# Altium project PCB_3U_DAC.PrjPCB (part 3 of 3)

## Sheet Thermal_MGM.SchDoc: Thermal
size 420 x 297 mm; Author: G.K.; CompanyName: WUT; DrawnBy: G.K.; Organization: WUT ISE; Address1: Warsaw Univeristy of Technology; Address2: Nowowiejska 15/19; DocumentNumber: 6; Revision: -; SheetNumber: 6; SheetTotal: 7; EDA_Number: ARTIQ; Projet: ARTIQ/SINARA; ModifiedBy: -; CreateDate: XX/XX/XXXX; CheckedDate: -; Title2: management; DivGrp: ISE; Designer: G.K.; ModifiedDate: -; ProjectName: 32 CHANNEL 16bit DAC
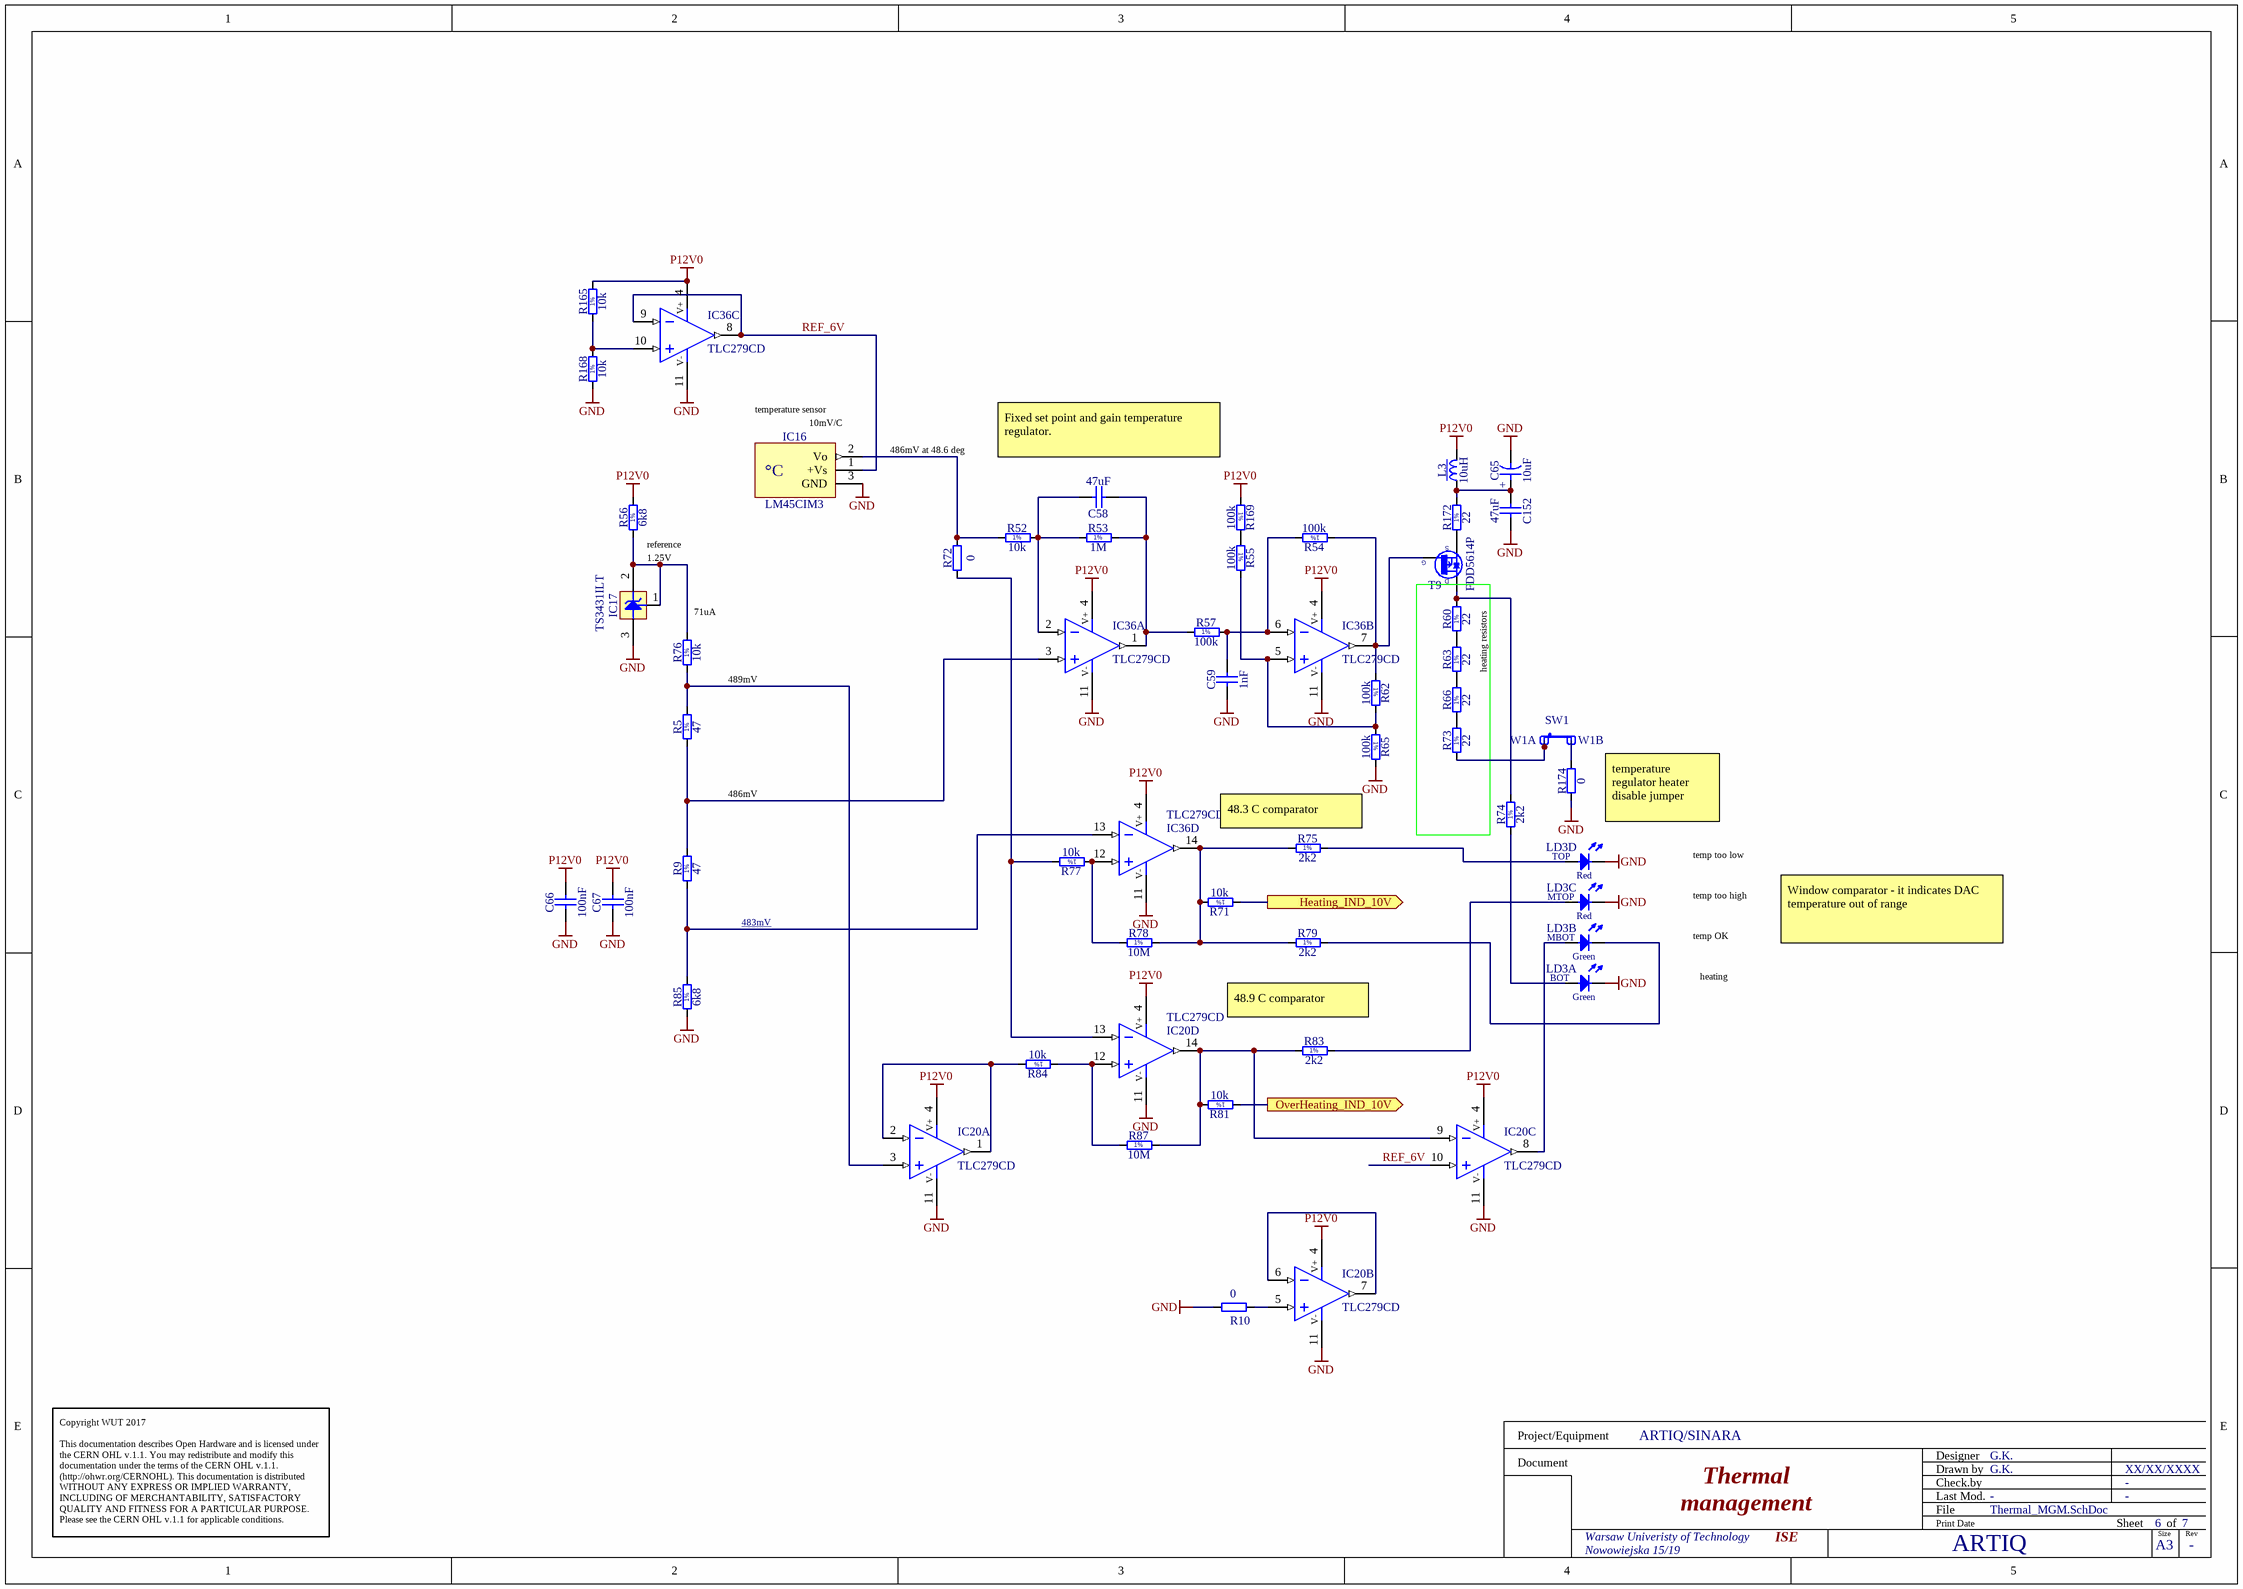
[diagram p5: Thermal_MGM.SchDoc]

### Parts
C58  47uF  [CAPC3225X270N]
C59  1nF  [CAPC1608X87N]
C65  10uF  [CAPMP3216X180N]
C66  100nF  [CAPC1005X55N]
C67  100nF  [CAPC1005X55N]
C152  47uF  [CAPC3225X270N]
IC16  LM45CIM3  [SOT95P251X112-3N]
IC17  TS3431ILT  [SOT95P237X112-3N]
IC20  TLC279CD  [SOIC127P600X175-14N]  (parts A,B,C,D of 4)
IC36  TLC279CD  [SOIC127P600X175-14N]  (parts A,B,C,D of 4)
L3  10uH  [IND_MURATA-PS_8400]
LD3  Green/Green/HeRed/HeRed  [LED_BIVAR_H485CHHGGDL]  (value not drawn)  (parts A,B,C,D of 4)
R5  47  [RESC1608X55N]
R9  47  [RESC1608X55N]
R10  0  [RESC1005X40N]
R52  10k  [RESC1608X55N]
R53  1M  [RESC1608X55N]
R54  100k  [RESC1608X55N]
R55  100k  [RESC1608X55N]
R56  6k8  [RESC1608X55N]
R57  100k  [RESC1608X55N]
R60  22  [RESC3216X65N]
R62  100k  [RESC1608X55N]
R63  22  [RESC3216X65N]
R65  100k  [RESC1608X55N]
R66  22  [RESC3216X65N]
R71  10k  [RESC1608X55N]
R72  0  [RESC1005X40N]
R73  22  [RESC3216X65N]
R74  2k2  [RESC1608X55N]
R75  2k2  [RESC1608X55N]
R76  10k  [RESC1608X55N]
R77  10k  [RESC1608X55N]
R78  10M  [RESC1508X63N]
R79  2k2  [RESC1608X55N]
R81  10k  [RESC1608X55N]
R83  2k2  [RESC1608X55N]
R84  10k  [RESC1608X55N]
R85  6k8  [RESC1608X55N]
R87  10M  [RESC1508X63N]
R165  10k  [RESC1608X55N]
R168  10k  [RESC1608X55N]
R169  100k  [RESC1608X55N]
R172  22  [RESC3216X65N]
R174  0  [RESC1005X40N]
SW1  Jumper Type1  [JUMPER_BLACK_INSULATED_2.54MM]  (value not drawn)
T9  FDD5614P  [TO228P991X238-3N-R546X521]
W1  Test Point  [COMATEL_385.0358.1.02.400]  (value not drawn)  (parts A,B of 2)

### Ports
Heating_IND_10V (out), OverHeating_IND_10V (out)

### Nets
GND: C59.1 C65.2 C66.1 C67.1 C152.2 IC16.3(GND) IC17.3(A) IC20.11(V-) IC36.11(V-) LD3.1(C) LD3.5(C) LD3.7(C) R10.2 R65.2 R85.1 R168.1 R174.1
P12V0: C66.2 C67.2 IC20.4(V+) IC36.4(V+) L3.2 R56.2 R165.2 R169.1
REF_6V: IC16.1(+Vs) IC20.10(IN+) IC36.8(OUT) IC36.9(IN-)
NetC58_1: C58.1 IC36.1(OUT) R53.2 R57.1
NetC58_2: C58.2 IC36.2(IN-) R52.2 R53.1
NetC59_2: C59.2 IC36.6(IN-) R54.2 R57.2
NetC65_1: C65.1 C152.1 L3.1 R172.2
NetIC13_4: R81.1 ; port OverHeating_IND_10V
NetIC13_5: R71.1 ; port Heating_IND_10V
NetIC16_2: IC16.2(Vo) R52.1 R72.2
NetIC17_1: IC17.1(Adj) IC17.2(C) R56.1 R76.2
NetIC20_1: IC20.1(OUT) IC20.2(IN-) R84.2
NetIC20_3: IC20.3(IN+) R5.2 R76.1
NetIC20_5: IC20.5(IN+) R10.1
NetIC20_6: IC20.6(IN-) IC20.7(OUT)
NetIC20_8: IC20.8(OUT) LD3.4(A)
NetIC20_9: IC20.9(IN-) IC20.14(OUT) R81.2 R83.1 R87.2
NetIC20_12: IC20.12(IN+) R84.1 R87.1
NetIC20_13: IC20.13(IN-) R72.1 R77.2
NetIC36_3: IC36.3(IN+) R5.1 R9.2
NetIC36_5: IC36.5(IN+) R55.2 R62.2 R65.1
NetIC36_7: IC36.7(OUT) R54.1 R62.1 T9.1(G)
NetIC36_10: IC36.10(IN+) R165.1 R168.2
NetIC36_12: IC36.12(IN+) R77.1 R78.1
NetIC36_13: IC36.13(IN-) R9.1 R85.2
NetIC36_14: IC36.14(OUT) R71.2 R75.1 R78.2 R79.1
NetLD3_2: LD3.2(A) R74.1
NetLD3_3: LD3.3(C) R79.2
NetLD3_6: LD3.6(A) R83.2
NetLD3_8: LD3.8(A) R75.2
NetR55_1: R55.1 R169.2
NetR60_1: R60.1 R63.2
NetR60_2: R60.2 R74.2 T9.3(D)
NetR63_1: R63.1 R66.2
NetR66_1: R66.1 R73.2
NetR73_1: R73.1 SW1.1 W1.1
NetR172_1: R172.1 T9.2(S)
NetR174_2: R174.2 W1.2

### Notes on the sheet
- temperature sensor
- (near IC16) 10mV/C
- 486mV at 48.6 deg
- Fixed set point and gain temperature regulator.
- 1.25V
- (near R56) reference
- (near R76) 71uA
- heating resistors
- 489mV
- 486mV
- (near R75) 48.3 C comparator
- temperature regulator heater disable jumper
- temp too low
- 483mV
- temp too high
- temp OK
- Window comparator - it indicates DAC temperature out of range
- heating
- 48.9 C comparator
- Copyright WUT 2017
  This documentation describes Open Hardware and is licensed under the CERN OHL v.1.1. You may redistribute and modify this documentation under the terms of the CERN OHL v.1.1. (http://ohwr.org/CERNOHL). This documentation is distributed WITHOUT ANY EXPRESS OR IMPLIED WARRANTY, INCLUDING OF MERCHANTABILITY, SATISFACTORY QUALITY AND FITNESS FOR A PARTICULAR PURPOSE. Please see the CERN OHL v.1.1 for applicable conditions.
- Project/Equipment
- Document
- Designer
- Drawn by
- Check.by
- File
- Last Mod.
- Print Date
- Sheet
- Size
- A3
- of
- Rev
- (in symbol CTE3216-18_10UF_16V_20%_AVX_TCJ) +
- (in symbol LED_BIVAR_H485CHHGGDL, part A) BOT; Green
- (in symbol LED_BIVAR_H485CHHGGDL, part B) MBOT; Green
- (in symbol LED_BIVAR_H485CHHGGDL, part C) MTOP; Red
- (in symbol LED_BIVAR_H485CHHGGDL, part D) TOP; Red
- (in symbol LM45CIM3) °C
- (in symbol R0603_1M_1%_0.1W_100PPM) 1%
- (in symbol R0603_2K2_1%_0.1W_100PPM) 1%
- (in symbol R0603_6K8_1%_0.1W_100PPM) 1%
- (in symbol R0603_10K_1%_0.1W_100PPM) 1%
- (in symbol R0603_10M_1%_0.125W_100PPM_VISHAY_CHP) 1%
- (in symbol R0603_47R_1%_0.1W_100PPM) 1%
- (in symbol R0603_100K_1%_0.1W_100PPM) 1%
- (in symbol R1206_22R_1%_0.25W_100PPM) 1%

### Library data of the parts
C58 C152 = CC1210_47UF_10V_10%_X7R: Non-polarised capacitor; Part Description: SMD Multilayer Chip Ceramic Capacitor; Manufacturer: GENERIC; Manufacturer1 Part Number: GRM32ER71A476KE15; Voltage: 10V; TC: X7R; Tolerance: ±10%; Part Number: CC1210_47UF_10V_10%_X7R; Component Kind: Standard; Component Type: Standard; Pin Count: 2; Value: 47uF; Status: None; Manufacturer Part Number: CC1210_47UF_10V_10%_X7R; Case: 1210; Mounted: Yes; Socket: No; SMD: Yes; Sense: No; Manufacturer1 Example: MURATA; Manufacturer1 ComponentHeight: 2.7mm; HelpURL: \\cern.ch\dfs\Applications\Altium\Datasheets\CC1210_X7R_MURATA.pdf; Author: CERN DEM BC; CreateDate: 18.11.2015; LatestRevisionDate: 18.11.2015
C59 = CC0603_1NF_50V_10%_X7R: Non-polarised capacitor; Part Description: SMD Multilayer Chip Ceramic Capacitor; Manufacturer: GENERIC; Manufacturer1 Part Number: 223858615623; Voltage: 50V; TC: X7R; Tolerance: ±10%; Part Number: CC0603_1NF_50V_10%_X7R; Component Kind: Standard; Component Type: Standard; Pin Count: 2; Value: 1nF; Status: Preferred; Manufacturer Part Number: CC0603_1NF_50V_10%_X7R; Case: 0603; Mounted: Yes; Socket: No; SMD: Yes; Sense: No; Manufacturer1 Example: PHYCOMP; Manufacturer1 ComponentHeight: 0.87mm; HelpURL: \\cern.ch\dfs\Applications\Altium\Datasheets\CC0603_X7R_PHYCOMP.pdf; Author: CERN DEM JLC; CreateDate: 03.12.2007; LatestRevisionDate: 03.12.2007
C65 = CTE3216-18_10UF_16V_20%_AVX_TCJ: Polarised capacitor; Part Description: ESR 0R200 Tantalum Solid Electrolytic Chip Capacitor with Conductive Polymer Electrode; Manufacturer: AVX; Manufacturer Part Number: TCJA106M016R0200; Voltage: 16V; Tolerance: ±20%; Part Number: CTE3216-18_10UF_16V_20%_AVX_TCJ; Component Kind: Standard; Component Type: Standard; Pin Count: 2; Value: 10uF; Status: Preferred; Case: A; Mounted: Yes; Socket: No; SMD: Yes; Sense: No; ComponentHeight: 1.8mm; HelpURL: \\cern.ch\dfs\Applications\Altium\Datasheets\CTE_AVX_TCJ.pdf; Author: CERN DEM JLC; CreateDate: 29.03.2012; LatestRevisionDate: 29.03.2012
C66 C67 = CC0402_100NF_16V_10%_X7R: Non-polarised capacitor; Part Description: SMD Multilayer Chip Ceramic Capacitor; Manufacturer: GENERIC; Manufacturer1 Part Number: GRM155R71C104KA88D; Voltage: 16V; TC: X7R; Tolerance: ±10%; Part Number: CC0402_100NF_16V_10%_X7R; Component Kind: Standard; Component Type: Standard; Pin Count: 2; Value: 100nF; Status: Not Recommended; Manufacturer Part Number: CC0402_100NF_16V_10%_X7R; Case: 0402; Mounted: Yes; Socket: No; SMD: Yes; Sense: No; Manufacturer1 Example: MURATA; Manufacturer1 ComponentHeight: 0.55mm; HelpURL: \\cern.ch\dfs\Applications\Altium\Datasheets\CC0402_X7R_MURATA_GRM.pdf; Author: CERN DEM JLC; CreateDate: 2013-12-05; LatestRevisionDate: 2007-12-03
IC16 = LM45CIM3: -20° to +100°C ±3°C Precision Centigrade Temperature Sensors; Manufacturer: NATIONAL SEMICONDUCTOR; PressFit: No; Bonding: No; Part Number: LM45CIM3; Component Kind: Standard; Component Type: Standard; Device: LM45CIM3; PackageDescription: SOT23 3-Leads, Pitch 0.95mm - Body 1.3x2.9mm, IPC Medium Density; Status: Obsolete; Part Description: -20° to +100°C ±3°C Precision Centigrade Temperature Sensors; Manufacturer Part Number: LM45CIM3; Pin Count: 3; Case: SOT23; Mounted: Yes; Socket: No; SMD: Yes; Sense: No; ComponentHeight: 1.12mm; HelpURL: \\cern.ch\dfs\Applications\Altium\Datasheets\LM45CIM3.pdf; Author: CERN DEM JLC; CreateDate: 02.12.2009; LatestRevisionDate: 02.12.2009
IC17 = TS3431ILT: Precision Reference 1=Adj 2=Cathode 3=Anode; Part Description: 1.24 V Programmable Shunt Voltage Reference; Manufacturer: ST MICROELECTRONICS; PressFit: No; Bonding: No; Part Number: TS3431ILT; Component Kind: Standard; Component Type: Standard; Device: TS3431ILT; PackageDescription: SOT, 0.95mm, pitch; 3 pin,1.30mm W X 2.92mm L X 1.12mm H body, IPC Medium Density; Manufacturer Part Number: TS3431ILT; Pin Count: 3; Case: SOT23; Mounted: Yes; Socket: No; SMD: Yes; Sense: No; ComponentHeight: 1.12mm; HelpURL: \\cern.ch\dfs\Applications\Altium\Datasheets\TS3431ILT.pdf; Author: CERN DEM JLC; CreateDate: 17.11.2016; LatestRevisionDate: 17.11.2016
IC20 IC36 = OA_TLC279CD: LinCMOS Precision (900uV) Quad Operational Amplifier; Part Description: LinCMOS Precision Quad Operational Amplifier; Manufacturer: TEXAS INSTRUMENTS; PressFit: No; Bonding: No; Part Number: TLC279CD; Component Kind: Standard; Component Type: Standard; Device: TLC279CD; PackageDescription: SOIC 14, Pitch 1.27mm - Body 4x8.75mm, IPC Medium Density; Manufacturer Part Number: TLC279CD; Pin Count: 14; Case: SOIC14; Mounted: Yes; Socket: No; SMD: Yes; Sense: No; ComponentHeight: 1.75mm; Author: CERN DEM JLC; HelpURL: \\cern.ch\dfs\Applications\Altium\Datasheets\TLC274CD.pdf; CreateDate: 18.01.2011; LatestRevisionDate: 18.01.2011
L3 = IND_10UH_10%_MURATA-PS_8400: Inductor With Core; Part Description: Miniature Surface Mount Power Inductor (8400 Serie); Manufacturer: MURATA POWER SOLUTIONS; Manufacturer Part Number: 84103C; Power: 950mA; Resistance: 0.24R; Tolerance: ±10%; Part Number: IND_10UH_10%_MURATA-PS_8400; Component Kind: Standard; Component Type: Standard; Pin Count: 2; Value: 10uH; Status: None; Mounted: Yes; Socket: No; SMD: Yes; Sense: No; ComponentHeight: 2.9mm; HelpURL: \\cern.ch\dfs\Applications\Altium\Datasheets\IND_MURATA-PS_8400.pdf; Author: CERN DEM JLC; CreateDate: 02.07.2012; LatestRevisionDate: 02.07.2012
LD3 = LED_BIVAR_H485CHHGGDL: LED x4 G-1C2A-BOT_G-3C4A_H-5C6A_H-7C8A-TOP; Part Description: Quad-Level 2mm (Green+Green+HeRed+HeRed) LED, PCB Edge Mounting; Manufacturer: BIVAR; PressFit: No; Bonding: No; Part Number: LED_BIVAR_H485CHHGGDL; Component Kind: Standard; Component Type: Standard; Color: Green/Green/HeRed/HeRed; PackageDescription: Quad-Level 2mm (Green+Green+HeRed+HeRed) LED, PCB Edge Mounting  BIVAR H485C Serie; Status: Not Recommanded; Manufacturer Part Number: H485CHHGGDL; Pin Count: 8; Mounted: Yes; Socket: No; SMD: No; Sense: No; ComponentHeight: 11.3mm; HelpURL: \\cern.ch\dfs\Applications\Altium\Datasheets\LED_BIVAR_H485C.pdf; Author: CERN DEM BC; CreateDate: 12.11.2015; LatestRevisionDate: 12.11.2015
R5 R9 = R0603_47R_1%_0.1W_100PPM: Resistor - 1%; Part Description: General Purpose Thick Film Chip Resistor; Manufacturer: GENERIC; Manufacturer1 Part Number: NRC06F47R0TRF; Power: 0.1W; TC: ±100ppm/°C; Part Number: R0603_47R_1%_0.1W_100PPM; Component Kind: Standard; Component Type: Standard; Pin Count: 2; Value: 47; Status: Preferred; Tolerance: ±1%; Manufacturer Part Number: R0603_47R_1%_0.1W_100PPM; Case: 0603; Mounted: Yes; Sense: No; Socket: No; SMD: Yes; Manufacturer1 Example: NIC COMPONENT; Manufacturer1 ComponentHeight: 0.55mm; HelpURL: \\cern.ch\dfs\Applications\Altium\Datasheets\R0603_NIC_NRC.pdf; Author: CERN DEM JLC; CreateDate: 03.12.2007; LatestRevisionDate: 13.03.2008
R10 R72 R174 = R0402_0R_JUMPER: Resistor; Part Description: 1A (0.05R Max DC Resistance) Zero Ohm Jumper; Manufacturer: GENERIC; Manufacturer1 Part Number: 232270591001L; Part Number: R0402_0R_JUMPER; Component Kind: Standard; Component Type: Standard; Pin Count: 2; Value: 0; Status: Not recommended; Manufacturer Part Number: R0402_0R_JUMPER; Case: 0402; Mounted: Yes; Sense: No; Socket: No; SMD: Yes; Manufacturer1 Example: YAGEO PHYCOMP; Manufacturer1 ComponentHeight: 0.4mm; HelpURL: \\cern.ch\dfs\Applications\Altium\Datasheets\R0402_Phycomp_RC0402.pdf; Author: CERN DEM JLC; CreateDate: 03.12.2007; LatestRevisionDate: 17.10.2012
R52 R71 R76 R77 R81 R84 R165 R168 = R0603_10K_1%_0.1W_100PPM: Resistor - 1%; Part Description: General Purpose Thick Film Chip Resistor; Manufacturer: GENERIC; Manufacturer1 Part Number: NRC06F1002TRF; Power: 0.1W; TC: ±100ppm/°C; Part Number: R0603_10K_1%_0.1W_100PPM; Component Kind: Standard; Component Type: Standard; Pin Count: 2; Value: 10k; Status: Preferred; Tolerance: ±1%; Manufacturer Part Number: R0603_10K_1%_0.1W_100PPM; Case: 0603; Mounted: Yes; Sense: No; Socket: No; SMD: Yes; Manufacturer1 Example: NIC COMPONENT; Manufacturer1 ComponentHeight: 0.55mm; HelpURL: \\cern.ch\dfs\Applications\Altium\Datasheets\R0603_NIC_NRC.pdf; Author: CERN DEM JLC; CreateDate: 03.12.2007; LatestRevisionDate: 13.03.2008
R53 = R0603_1M_1%_0.1W_100PPM: Resistor - 1%; Part Description: General Purpose Thick Film Chip Resistor; Manufacturer: GENERIC; Manufacturer1 Part Number: NRC06F1004TRF; Power: 0.1W; TC: ±100ppm/°C; Part Number: R0603_1M_1%_0.1W_100PPM; Component Kind: Standard; Component Type: Standard; Pin Count: 2; Value: 1M; Status: Preferred; Tolerance: ±1%; Manufacturer Part Number: R0603_1M_1%_0.1W_100PPM; Case: 0603; Mounted: Yes; Sense: No; Socket: No; SMD: Yes; Manufacturer1 Example: NIC COMPONENT; Manufacturer1 ComponentHeight: 0.55mm; HelpURL: \\cern.ch\dfs\Applications\Altium\Datasheets\R0603_NIC_NRC.pdf; Author: CERN DEM JLC; CreateDate: 03.12.2007; LatestRevisionDate: 13.03.2008
R54 R55 R57 R62 R65 R169 = R0603_100K_1%_0.1W_100PPM: Resistor - 1%; Part Description: General Purpose Thick Film Chip Resistor; Manufacturer: GENERIC; Manufacturer1 Part Number: NRC06F1003TRF; Power: 0.1W; TC: ±100ppm/°C; Part Number: R0603_100K_1%_0.1W_100PPM; Component Kind: Standard; Component Type: Standard; Pin Count: 2; Value: 100k; Status: Preferred; Tolerance: ±1%; Manufacturer Part Number: R0603_100K_1%_0.1W_100PPM; Case: 0603; Mounted: Yes; Sense: No; Socket: No; SMD: Yes; Manufacturer1 Example: NIC COMPONENT; Manufacturer1 ComponentHeight: 0.55mm; HelpURL: \\cern.ch\dfs\Applications\Altium\Datasheets\R0603_NIC_NRC.pdf; Author: CERN DEM JLC; CreateDate: 03.12.2007; LatestRevisionDate: 13.03.2008
R56 R85 = R0603_6K8_1%_0.1W_100PPM: Resistor - 1%; Part Description: General Purpose Thick Film Chip Resistor; Manufacturer: GENERIC; Manufacturer1 Part Number: NRC06F6801TRF; Power: 0.1W; TC: ±100ppm/°C; Part Number: R0603_6K8_1%_0.1W_100PPM; Component Kind: Standard; Component Type: Standard; Pin Count: 2; Value: 6k8; Status: Preferred; Tolerance: ±1%; Manufacturer Part Number: R0603_6K8_1%_0.1W_100PPM; Case: 0603; Mounted: Yes; Sense: No; Socket: No; SMD: Yes; Manufacturer1 Example: NIC COMPONENT; Manufacturer1 ComponentHeight: 0.55mm; HelpURL: \\cern.ch\dfs\Applications\Altium\Datasheets\R0603_NIC_NRC.pdf; Author: CERN DEM JLC; CreateDate: 03.12.2007; LatestRevisionDate: 13.03.2008
R60 R63 R66 R73 R172 = R1206_22R_1%_0.25W_100PPM: Resistor - 1%; Part Description: General Purpose Thick Film Chip Resistor; Manufacturer: GENERIC; Manufacturer1 Part Number: NRC12F22R0TRF; Power: 0.25W; TC: ±100ppm/°C; Part Number: R1206_22R_1%_0.25W_100PPM; Component Kind: Standard; Component Type: Standard; Pin Count: 2; Value: 22; Status: Preferred; Tolerance: ±1%; Manufacturer Part Number: R1206_22R_1%_0.25W_100PPM; Case: 1206; Mounted: Yes; Sense: No; Socket: No; SMD: Yes; Manufacturer1 Example: NIC COMPONENT; Manufacturer1 ComponentHeight: 0.65mm; HelpURL: \\cern.ch\dfs\Applications\Altium\Datasheets\R1206_NIC_NRC.pdf; Author: CERN DEM JLC; CreateDate: 03.12.2007; LatestRevisionDate: 13.03.2008
R74 R75 R79 R83 = R0603_2K2_1%_0.1W_100PPM: Resistor - 1%; Part Description: General Purpose Thick Film Chip Resistor; Manufacturer: GENERIC; Manufacturer1 Part Number: NRC06F2201TRF; Power: 0.1W; TC: ±100ppm/°C; Part Number: R0603_2K2_1%_0.1W_100PPM; Component Kind: Standard; Component Type: Standard; Pin Count: 2; Value: 2k2; Status: Preferred; Tolerance: ±1%; Manufacturer Part Number: R0603_2K2_1%_0.1W_100PPM; Case: 0603; Mounted: Yes; Sense: No; Socket: No; SMD: Yes; Manufacturer1 Example: NIC COMPONENT; Manufacturer1 ComponentHeight: 0.55mm; HelpURL: \\cern.ch\dfs\Applications\Altium\Datasheets\R0603_NIC_NRC.pdf; Author: CERN DEM JLC; CreateDate: 03.12.2007; LatestRevisionDate: 13.03.2008
R78 R87 = R0603_10M_1%_0.125W_100PPM_VISHAY_CHP: Resistor - 1%; Part Description: High Stability Metal Glaze Thick Film Chip Resistor; Manufacturer: VISHAY SFERNICE; Manufacturer Part Number: CHP0603K1005FNT; Power: 0.125W; TC: ±100ppm/°C; Part Number: R0603_10M_1%_0.125W_100PPM_VISHAY_CHP; Component Kind: Standard; Component Type: Standard; Pin Count: 2; Value: 10M; Status: None; Tolerance: ±1%; Case: 0603; Mounted: Yes; Sense: No; Socket: No; SMD: Yes; HelpURL: \\cern.ch\dfs\Applications\Altium\Datasheets\R0603_VISHAY_CHP.pdf; Author: CERN DEM JLC; CreateDate: 22.06.2011; LatestRevisionDate: 22.06.2011; ComponentHeight: 0.63mm
SW1 = COMATEL_313.1730.0.00.40.0: Jumper 1 Pin; Part Description: Closed Insulated Black Jumper Pitch 2.54mm; Manufacturer: KONTEK COMATEL; PressFit: No; SCEM: 09.55.10.960.9; Part Number: COMATEL_313.1730.0.00.40.0; Component Kind: Standard; Component Type: Standard; Pin Count: 1; Family: Jumper; Mounted: Yes; Socket: No; SMD: No; Sense: No; Status: Obsolete; Manufacturer Part Number: 313.1730.0.00.40.0; ComponentHeight: 6.5mm; HelpURL: \\cern.ch\dfs\Applications\Altium\Datasheets\COMATEL_313.1730.0.00.40.0.pdf; Author: CERN DEM JLC; CreateDate: 09.04.2008; LatestRevisionDate: 27.08.2013
T9 = FDD5614P: P-CHANNEL MOSFET WITH DIODE; Part Description: -60V -15A P-Channel PowerTrench® MOSFET; Manufacturer: FAIRCHILD SEMICONDUCTOR; PressFit: No; Bonding: No; Part Number: FDD5614P; Component Kind: Standard; Component Type: Standard; Device: FDD5614P; PackageDescription: TO-252AA DPAK TO, 2.28mm pitch; 2 pin,9.905mm L X 6.095mm W X 2.38mm H body, IPC Medium Density; Manufacturer Part Number: FDD5614P; Pin Count: 3; Case: DPAK; Mounted: Yes; Socket: No; SMD: Yes; Sense: No; ComponentHeight: 2.38mm; HelpURL: \\cern.ch\dfs\Applications\Altium\Datasheets\FDD5614P.pdf; Author: CERN DEM JLC; CreateDate: 23.09.2009; LatestRevisionDate: 23.09.2009
W1 = COMATEL_385.0358.1.02.400: 2 Mini Wire-Wrap Contact Strip Header; Part Description: 2 Contacts Straight Strip Header Pitch 2.54mm L=6.3mm ''Mini-Wire-Wrap''; Manufacturer: KONTEK COMATEL; PressFit: No; Part Number: COMATEL_385.0358.1.02.400; Component Kind: Standard; Component Type: Standard; Pin Count: 2; Family: Test Point; Mounted: Yes; Socket: No; SMD: No; Sense: No; Status: Not recommended; Manufacturer Part Number: 385.0358.1.02.400; ComponentHeight: 8mm; HelpURL: \\cern.ch\dfs\Applications\Altium\Datasheets\COMATEL_385.0358.1.02.400.pdf; Author: CERN DEM JLC; CreateDate: 30.06.2010; LatestRevisionDate: 10.10.2012

## Sheet IDC2BNC.SchDoc: IDC to BNC
size 420 x 297 mm; Author: G.K.; CompanyName: WUT; DrawnBy: G.K.; Organization: WUT ISE; Address1: Warsaw Univeristy of Technology; Address2: Nowowiejska 15/19; DocumentNumber: 3; Revision: -; SheetNumber: 3; SheetTotal: 7; EDA_Number: ARTIQ; Projet: ARTIQ/SINARA; ModifiedBy: -; CreateDate: XX/XX/XXXX; CheckedDate: -; Title2: adapter; DivGrp: ISE; Designer: G.K.; ModifiedDate: -; ProjectName: 32 CHANNEL 16bit DAC
Used 4 times, as channels U_IDC2BNC, U_IDC2BNC, U_IDC2BNC, U_IDC2BNC. Parts and nets are listed once, with the designators drawn on the sheet.
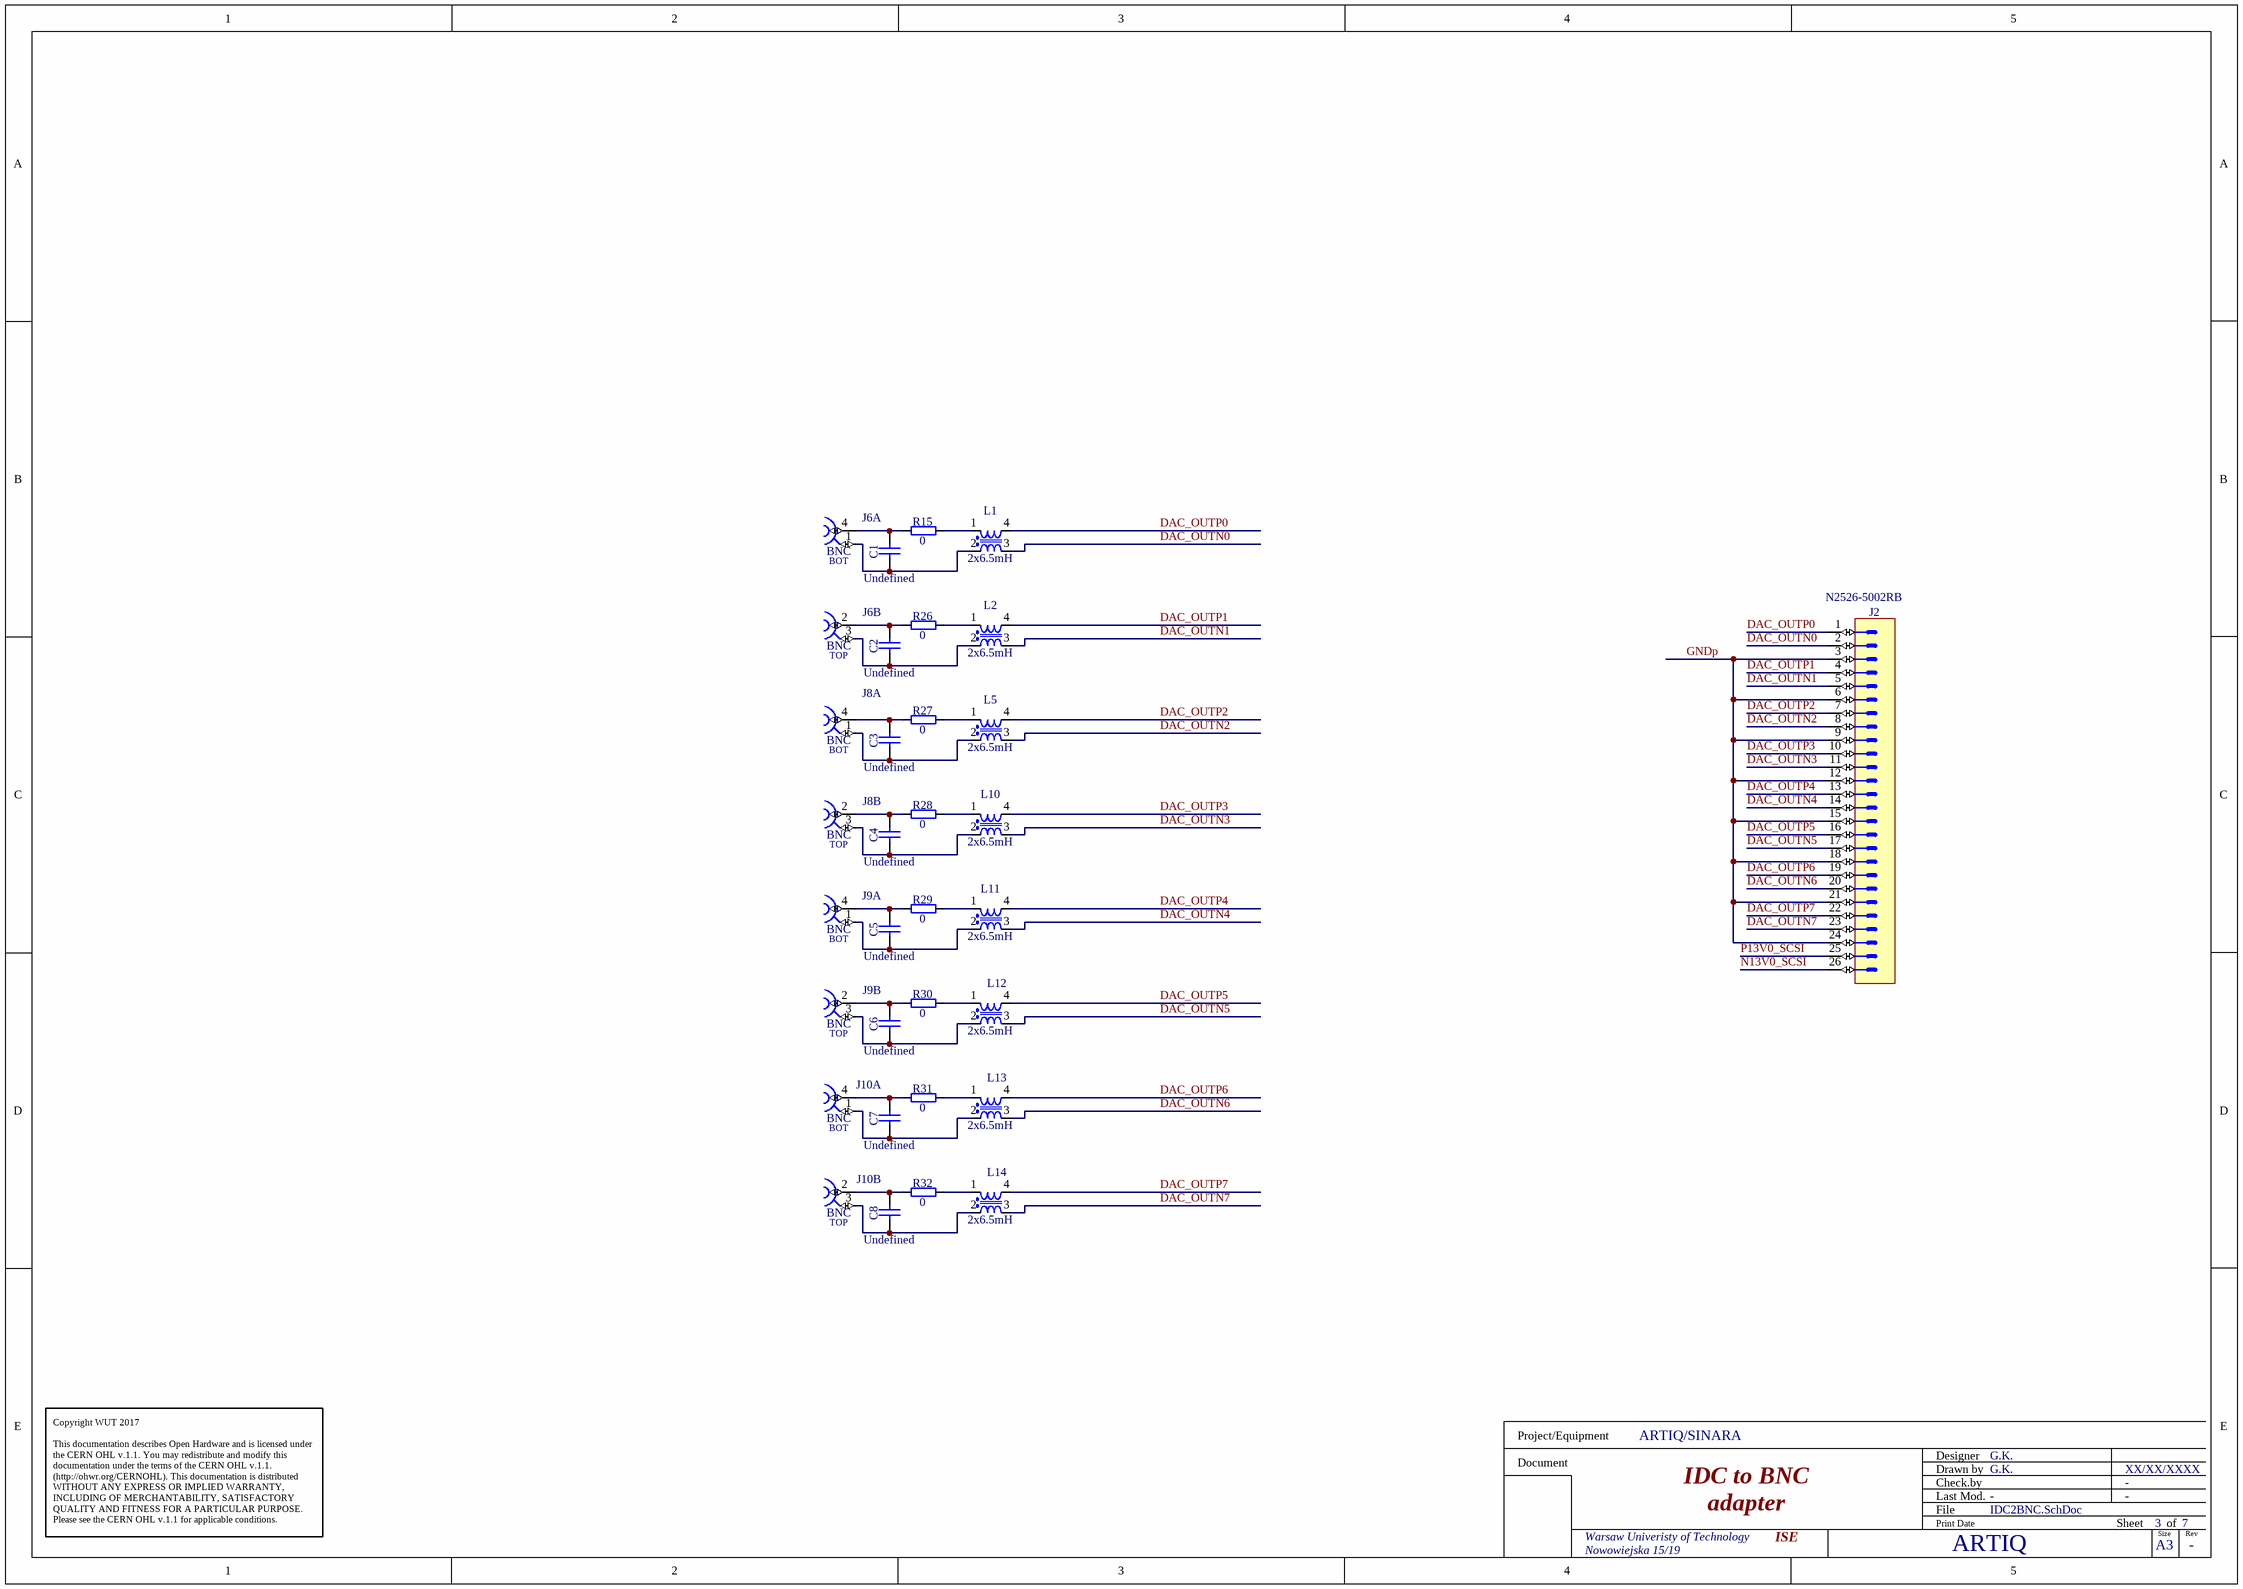
[diagram p6: IDC2BNC.SchDoc]

### Parts
C1  Undefined  [CAPC2012X135N]
C2  Undefined  [CAPC2012X135N]
C3  Undefined  [CAPC2012X135N]
C4  Undefined  [CAPC2012X135N]
C5  Undefined  [CAPC2012X135N]
C6  Undefined  [CAPC2012X135N]
C7  Undefined  [CAPC2012X135N]
C8  Undefined  [CAPC2012X135N]
J2  Manufacturer Part Number: N2526-5002RB  [3M_N2526-5002RB]  (hidden comment: Header 26)
J6  BNC  [BOMAR_364A2595]  (parts A,B of 2)
J8  BNC  [BOMAR_364A2595]  (parts A,B of 2)
J9  BNC  [BOMAR_364A2595]  (parts A,B of 2)
J10  BNC  [BOMAR_364A2595]  (parts A,B of 2)
L1  2x6.5mH  [IND_WURTH_WE-SL2]
L2  2x6.5mH  [IND_WURTH_WE-SL2]
L5  2x6.5mH  [IND_WURTH_WE-SL2]
L10  2x6.5mH  [IND_WURTH_WE-SL2]
L11  2x6.5mH  [IND_WURTH_WE-SL2]
L12  2x6.5mH  [IND_WURTH_WE-SL2]
L13  2x6.5mH  [IND_WURTH_WE-SL2]
L14  2x6.5mH  [IND_WURTH_WE-SL2]
R15  0  [RESC1608X55N]
R26  0  [RESC1608X55N]
R27  0  [RESC1608X55N]
R28  0  [RESC1608X55N]
R29  0  [RESC1608X55N]
R30  0  [RESC1608X55N]
R31  0  [RESC1608X55N]
R32  0  [RESC1608X55N]

### Nets
DAC_OUTN0: J2.2 L1.3
DAC_OUTN1: J2.5 L2.3
DAC_OUTN2: J2.8 L5.3
DAC_OUTN3: J2.11 L10.3
DAC_OUTN4: J2.14 L11.3
DAC_OUTN5: J2.17 L12.3
DAC_OUTN6: J2.20 L13.3
DAC_OUTN7: J2.23 L14.3
DAC_OUTP0: J2.1 L1.4
DAC_OUTP1: J2.4 L2.4
DAC_OUTP2: J2.7 L5.4
DAC_OUTP3: J2.10 L10.4
DAC_OUTP4: J2.13 L11.4
DAC_OUTP5: J2.16 L12.4
DAC_OUTP6: J2.19 L13.4
DAC_OUTP7: J2.22 L14.4
GNDp: J2.3 J2.6 J2.9 J2.12 J2.15 J2.18 J2.21 J2.24
N13V0_SCSI: J2.26
P13V0_SCSI: J2.25
NetC1_1: C1.1 J6.1 L1.2
NetC1_2: C1.2 J6.4 R15.1
NetC2_1: C2.1 J6.3 L2.2
NetC2_2: C2.2 J6.2 R26.1
NetC3_1: C3.1 J8.1 L5.2
NetC3_2: C3.2 J8.4 R27.1
NetC4_1: C4.1 J8.3 L10.2
NetC4_2: C4.2 J8.2 R28.1
NetC5_1: C5.1 J9.1 L11.2
NetC5_2: C5.2 J9.4 R29.1
NetC6_1: C6.1 J9.3 L12.2
NetC6_2: C6.2 J9.2 R30.1
NetC7_1: C7.1 J10.1 L13.2
NetC7_2: C7.2 J10.4 R31.1
NetC8_1: C8.1 J10.3 L14.2
NetC8_2: C8.2 J10.2 R32.1
NetL1_1: L1.1 R15.2
NetL2_1: L2.1 R26.2
NetL5_1: L5.1 R27.2
NetL10_1: L10.1 R28.2
NetL11_1: L11.1 R29.2
NetL12_1: L12.1 R30.2
NetL13_1: L13.1 R31.2
NetL14_1: L14.1 R32.2

### Channels
U_IDC2BNC: designators end in _1
U_IDC2BNC: designators end in _2
U_IDC2BNC: designators end in _3
U_IDC2BNC: designators end in _4

### Notes on the sheet
- Copyright WUT 2017
  This documentation describes Open Hardware and is licensed under the CERN OHL v.1.1. You may redistribute and modify this documentation under the terms of the CERN OHL v.1.1. (http://ohwr.org/CERNOHL). This documentation is distributed WITHOUT ANY EXPRESS OR IMPLIED WARRANTY, INCLUDING OF MERCHANTABILITY, SATISFACTORY QUALITY AND FITNESS FOR A PARTICULAR PURPOSE. Please see the CERN OHL v.1.1 for applicable conditions.
- Project/Equipment
- Document
- Designer
- Drawn by
- Check.by
- File
- Last Mod.
- Print Date
- Sheet
- Size
- A3
- of
- Rev
- (in symbol BOMAR_364A2595, part A) BOT
- (in symbol BOMAR_364A2595, part B) TOP

### Library data of the parts
C1-C8 = CC0805_NO-VALUE: Non-polarised capacitor; Part Description: Reserved Footprint For 0805(2012) Chip Ceramic Capacitor; Mounted: No; Part Number: CC0805_NO-VALUE; Component Kind: Standard; Component Type: Standard; Pin Count: 2; Value: Undefined; Status: None; Manufacturer: Undefined; Manufacturer Part Number: CC0805_NO-VALUE; Case: 0805; Socket: No; SMD: Yes; Sense: No; Manufacturer1 ComponentHeight: 1.35mm; HelpURL: Undefined; Author: CERN DEM JLC; CreateDate: 10.12.2008; LatestRevisionDate: 11.09.2013
J2 = 3M_N2526-5002RB: Connector 26 Male; Part Description: 26 Contacts - Right Angle .100" x .100" Low Profile Four-Wall Header, 2500 Series; Manufacturer: 3M; PressFit: No; Part Number: 3M_N2526-5002RB; Component Kind: Standard; Component Type: Standard; Pin Count: 26; Family: Header 26; Mounted: Yes; Socket: No; SMD: No; Sense: No; Status: None; ComponentHeight: 8.59mm; HelpURL: \\cern.ch\dfs\Applications\Altium\Datasheets\3M_N2526-5002RB.pdf; Author: CERN DEM JLC; CreateDate: 29.10.2008; LatestRevisionDate: 11.08.2009
J6 J8-J10 = BOMAR_364A2595: Dual Right Angle 50 Ohm BNC Jack, White Valox Case; Manufacturer: BOMAR INTERCONNECT; PressFit: No; Part Number: BOMAR_364A2595; Component Kind: Standard; Component Type: Standard; Pin Count: 6; Family: BNC; Mounted: Yes; Socket: No; SMD: No; Sense: No; Status: None; Part Description: Dual Right Angle 50 Ohm BNC Jack, White Valox Case; Manufacturer Part Number: 364A2595; ComponentHeight: 29.3mm; HelpURL: \\cern.ch\dfs\Applications\Altium\Datasheets\BOMAR_364A2595.pdf; Author: CERN DEM JLC; CreateDate: 09.04.2013; LatestRevisionDate: 09.04.2013
L1 L2 L5 L10-L14 = IND_6.5MH_50%_WURTH_WE-SL2-744229: Inductor Common Mode; Part Description: Common Mode SMD Line Filter (WE-SL2 Serie); Manufacturer: WURTH ELEKTRONIK; Manufacturer Part Number: 744229; Power: 400mA; Resistance: 0.95R; Tolerance: ±50%; Part Number: IND_6.5MH_50%_WURTH_WE-SL2-744229; Component Kind: Standard; Component Type: Standard; Pin Count: 4; Value: 2x6.5mH; Status: None; Mounted: Yes; Socket: No; SMD: Yes; Sense: No; ComponentHeight: 5.3mm; HelpURL: \\cern.ch\dfs\Applications\Altium\Datasheets\IND_WURTH_WE-SL2_744229.pdf; Author: CERN DEM JLC; CreateDate: 01.10.2012; LatestRevisionDate: 15.10.2012
R15 R26-R32 = R0603_0R_JUMPER: Resistor; Part Description: 1A (0.05R Max DC Resistance) Zero Ohm Jumper; Manufacturer: GENERIC; Manufacturer1 Part Number: NRC06Z0; Part Number: R0603_0R_JUMPER; Component Kind: Standard; Component Type: Standard; Pin Count: 2; Value: 0; Status: Preferred; Manufacturer Part Number: R0603_0R_JUMPER; Case: 0603; Mounted: Yes; Sense: No; Socket: No; SMD: Yes; Manufacturer1 Example: NIC COMPONENT; Manufacturer1 ComponentHeight: 0.55mm; HelpURL: \\cern.ch\dfs\Applications\Altium\Datasheets\R0603_NIC_NRC.pdf; Author: CERN DEM JLC; CreateDate: 03.12.2007; LatestRevisionDate: 13.03.2008

## Nets that join several sheets
DAC_VDD: Supply_DAC (C128.2 C135.1 IC29.5 R156.2), DAC_32CH (5 pins)
DAC_VSS: Supply_DAC (C146.1 IC33.5 R159.2), DAC_32CH (5 pins)
GND: PCB_3U_DAC (77 pins), Supply_DAC (49 pins), U_Output_channel1 (8 pins), U_Output_channel2 (8 pins), U_Output_channel3 (8 pins), U_Output_channel4 (8 pins), U_Output_channel5 (8 pins), U_Output_channel6 (8 pins), U_Output_channel7 (8 pins), U_Output_channel8 (8 pins), U_Output_channel9 (8 pins), U_Output_channel10 (8 pins), U_Output_channel11 (8 pins), U_Output_channel12 (8 pins), U_Output_channel13 (8 pins), U_Output_channel14 (8 pins), U_Output_channel15 (8 pins), U_Output_channel16 (8 pins), U_Output_channel17 (8 pins), U_Output_channel18 (8 pins), U_Output_channel19 (8 pins), U_Output_channel20 (8 pins), U_Output_channel21 (8 pins), U_Output_channel22 (8 pins), U_Output_channel23 (8 pins), U_Output_channel24 (8 pins), U_Output_channel25 (8 pins), U_Output_channel26 (8 pins), U_Output_channel27 (8 pins), U_Output_channel28 (8 pins), U_Output_channel29 (8 pins), U_Output_channel30 (8 pins), U_Output_channel31 (8 pins), U_Output_channel32 (8 pins), DAC_32CH (27 pins), LVDS_IFC_DAC (50 pins), Thermal_MGM (17 pins)
N12V0A: U_Output_channel1 (C92_1.2 C93_1.2 D5_1.1 IC2_1.4), U_Output_channel2 (C92_2.2 C93_2.2 D5_2.1 IC2_2.4), U_Output_channel3 (C92_3.2 C93_3.2 D5_3.1 IC2_3.4), U_Output_channel4 (C92_4.2 C93_4.2 D5_4.1 IC2_4.4), U_Output_channel5 (C92_5.2 C93_5.2 D5_5.1 IC2_5.4), U_Output_channel6 (C92_6.2 C93_6.2 D5_6.1 IC2_6.4), U_Output_channel7 (C92_7.2 C93_7.2 D5_7.1 IC2_7.4), U_Output_channel8 (C92_8.2 C93_8.2 D5_8.1 IC2_8.4), U_Output_channel9 (C92_9.2 C93_9.2 D5_9.1 IC2_9.4), U_Output_channel10 (C92_10.2 C93_10.2 D5_10.1 IC2_10.4), U_Output_channel11 (C92_11.2 C93_11.2 D5_11.1 IC2_11.4), U_Output_channel12 (C92_12.2 C93_12.2 D5_12.1 IC2_12.4), U_Output_channel13 (C92_13.2 C93_13.2 D5_13.1 IC2_13.4), U_Output_channel14 (C92_14.2 C93_14.2 D5_14.1 IC2_14.4), U_Output_channel15 (C92_15.2 C93_15.2 D5_15.1 IC2_15.4), U_Output_channel16 (C92_16.2 C93_16.2 D5_16.1 IC2_16.4), U_Output_channel17 (C92_17.2 C93_17.2 D5_17.1 IC2_17.4), U_Output_channel18 (C92_18.2 C93_18.2 D5_18.1 IC2_18.4), U_Output_channel19 (C92_19.2 C93_19.2 D5_19.1 IC2_19.4), U_Output_channel20 (C92_20.2 C93_20.2 D5_20.1 IC2_20.4), U_Output_channel21 (C92_21.2 C93_21.2 D5_21.1 IC2_21.4), U_Output_channel22 (C92_22.2 C93_22.2 D5_22.1 IC2_22.4), U_Output_channel23 (C92_23.2 C93_23.2 D5_23.1 IC2_23.4), U_Output_channel24 (C92_24.2 C93_24.2 D5_24.1 IC2_24.4), U_Output_channel25 (C92_25.2 C93_25.2 D5_25.1 IC2_25.4), U_Output_channel26 (C92_26.2 C93_26.2 D5_26.1 IC2_26.4), U_Output_channel27 (C92_27.2 C93_27.2 D5_27.1 IC2_27.4), U_Output_channel28 (C92_28.2 C93_28.2 D5_28.1 IC2_28.4), U_Output_channel29 (C92_29.2 C93_29.2 D5_29.1 IC2_29.4), U_Output_channel30 (C92_30.2 C93_30.2 D5_30.1 IC2_30.4), U_Output_channel31 (C92_31.2 C93_31.2 D5_31.1 IC2_31.4), U_Output_channel32 (C92_32.2 C93_32.2 D5_32.1 IC2_32.4)
P3V3: PCB_3U_DAC (C96.2 IC19.4 IC23.10 IC23.16), Supply_DAC (6 pins), DAC_32CH (R7.1), LVDS_IFC_DAC (31 pins)
P12V0: Supply_DAC (C129.2 L8.2), LVDS_IFC_DAC (J37.28 J37.29), Thermal_MGM (8 pins)
P12V0A: U_Output_channel1 (C90_1.1 C91_1.2 D5_1.2 IC2_1.7), U_Output_channel2 (C90_2.1 C91_2.2 D5_2.2 IC2_2.7), U_Output_channel3 (C90_3.1 C91_3.2 D5_3.2 IC2_3.7), U_Output_channel4 (C90_4.1 C91_4.2 D5_4.2 IC2_4.7), U_Output_channel5 (C90_5.1 C91_5.2 D5_5.2 IC2_5.7), U_Output_channel6 (C90_6.1 C91_6.2 D5_6.2 IC2_6.7), U_Output_channel7 (C90_7.1 C91_7.2 D5_7.2 IC2_7.7), U_Output_channel8 (C90_8.1 C91_8.2 D5_8.2 IC2_8.7), U_Output_channel9 (C90_9.1 C91_9.2 D5_9.2 IC2_9.7), U_Output_channel10 (C90_10.1 C91_10.2 D5_10.2 IC2_10.7), U_Output_channel11 (C90_11.1 C91_11.2 D5_11.2 IC2_11.7), U_Output_channel12 (C90_12.1 C91_12.2 D5_12.2 IC2_12.7), U_Output_channel13 (C90_13.1 C91_13.2 D5_13.2 IC2_13.7), U_Output_channel14 (C90_14.1 C91_14.2 D5_14.2 IC2_14.7), U_Output_channel15 (C90_15.1 C91_15.2 D5_15.2 IC2_15.7), U_Output_channel16 (C90_16.1 C91_16.2 D5_16.2 IC2_16.7), U_Output_channel17 (C90_17.1 C91_17.2 D5_17.2 IC2_17.7), U_Output_channel18 (C90_18.1 C91_18.2 D5_18.2 IC2_18.7), U_Output_channel19 (C90_19.1 C91_19.2 D5_19.2 IC2_19.7), U_Output_channel20 (C90_20.1 C91_20.2 D5_20.2 IC2_20.7), U_Output_channel21 (C90_21.1 C91_21.2 D5_21.2 IC2_21.7), U_Output_channel22 (C90_22.1 C91_22.2 D5_22.2 IC2_22.7), U_Output_channel23 (C90_23.1 C91_23.2 D5_23.2 IC2_23.7), U_Output_channel24 (C90_24.1 C91_24.2 D5_24.2 IC2_24.7), U_Output_channel25 (C90_25.1 C91_25.2 D5_25.2 IC2_25.7), U_Output_channel26 (C90_26.1 C91_26.2 D5_26.2 IC2_26.7), U_Output_channel27 (C90_27.1 C91_27.2 D5_27.2 IC2_27.7), U_Output_channel28 (C90_28.1 C91_28.2 D5_28.2 IC2_28.7), U_Output_channel29 (C90_29.1 C91_29.2 D5_29.2 IC2_29.7), U_Output_channel30 (C90_30.1 C91_30.2 D5_30.2 IC2_30.7), U_Output_channel31 (C90_31.1 C91_31.2 D5_31.2 IC2_31.7), U_Output_channel32 (C90_32.1 C91_32.2 D5_32.2 IC2_32.7)
REF_VCC: Supply_DAC (C125.2 C127.1 IC28.5 R154.2), DAC_32CH (R3.1)
CSN_EXT: PCB_3U_DAC (IC23.12 R118.2), LVDS_IFC_DAC (R99.1)
DAC_OUT_N1: PCB_3U_DAC (J1.35 J3.2), U_Output_channel1 (L4_1.3)
DAC_OUT_N2: PCB_3U_DAC (J1.36 J3.5), U_Output_channel2 (L4_2.3)
DAC_OUT_N3: PCB_3U_DAC (J1.37 J3.8), U_Output_channel3 (L4_3.3)
DAC_OUT_N4: PCB_3U_DAC (J1.38 J3.11), U_Output_channel4 (L4_4.3)
DAC_OUT_N5: PCB_3U_DAC (J1.39 J3.14), U_Output_channel5 (L4_5.3)
DAC_OUT_N6: PCB_3U_DAC (J1.40 J3.17), U_Output_channel6 (L4_6.3)
DAC_OUT_N7: PCB_3U_DAC (J1.41 J3.20), U_Output_channel7 (L4_7.3)
DAC_OUT_N8: PCB_3U_DAC (J1.42 J3.23), U_Output_channel8 (L4_8.3)
DAC_OUT_N9: PCB_3U_DAC (J1.43 J4.2), U_Output_channel9 (L4_9.3)
DAC_OUT_N10: PCB_3U_DAC (J1.44 J4.5), U_Output_channel10 (L4_10.3)
DAC_OUT_N11: PCB_3U_DAC (J1.45 J4.8), U_Output_channel11 (L4_11.3)
DAC_OUT_N12: PCB_3U_DAC (J1.46 J4.11), U_Output_channel12 (L4_12.3)
DAC_OUT_N13: PCB_3U_DAC (J1.47 J4.14), U_Output_channel13 (L4_13.3)
DAC_OUT_N14: PCB_3U_DAC (J1.48 J4.17), U_Output_channel14 (L4_14.3)
DAC_OUT_N15: PCB_3U_DAC (J1.49 J4.20), U_Output_channel15 (L4_15.3)
DAC_OUT_N16: PCB_3U_DAC (J1.50 J4.23), U_Output_channel16 (L4_16.3)
DAC_OUT_N17: PCB_3U_DAC (J1.53 J5.2), U_Output_channel17 (L4_17.3)
DAC_OUT_N18: PCB_3U_DAC (J1.54 J5.5), U_Output_channel18 (L4_18.3)
DAC_OUT_N19: PCB_3U_DAC (J1.55 J5.8), U_Output_channel19 (L4_19.3)
DAC_OUT_N20: PCB_3U_DAC (J1.56 J5.11), U_Output_channel20 (L4_20.3)
DAC_OUT_N21: PCB_3U_DAC (J1.57 J5.14), U_Output_channel21 (L4_21.3)
DAC_OUT_N22: PCB_3U_DAC (J1.58 J5.17), U_Output_channel22 (L4_22.3)
DAC_OUT_N23: PCB_3U_DAC (J1.59 J5.20), U_Output_channel23 (L4_23.3)
DAC_OUT_N24: PCB_3U_DAC (J1.60 J5.23), U_Output_channel24 (L4_24.3)
DAC_OUT_N25: PCB_3U_DAC (J1.61 J7.2), U_Output_channel25 (L4_25.3)
DAC_OUT_N26: PCB_3U_DAC (J1.62 J7.5), U_Output_channel26 (L4_26.3)
DAC_OUT_N27: PCB_3U_DAC (J1.63 J7.8), U_Output_channel27 (L4_27.3)
DAC_OUT_N28: PCB_3U_DAC (J1.64 J7.11), U_Output_channel28 (L4_28.3)
DAC_OUT_N29: PCB_3U_DAC (J1.65 J7.14), U_Output_channel29 (L4_29.3)
DAC_OUT_N30: PCB_3U_DAC (J1.66 J7.17), U_Output_channel30 (L4_30.3)
DAC_OUT_N31: PCB_3U_DAC (J1.67 J7.20), U_Output_channel31 (L4_31.3)
DAC_OUT_N32: PCB_3U_DAC (J1.68 J7.23), U_Output_channel32 (L4_32.3)
DAC_OUT_P1: PCB_3U_DAC (J1.1 J3.1), U_Output_channel1 (L4_1.4)
DAC_OUT_P2: PCB_3U_DAC (J1.2 J3.4), U_Output_channel2 (L4_2.4)
DAC_OUT_P3: PCB_3U_DAC (J1.3 J3.7), U_Output_channel3 (L4_3.4)
DAC_OUT_P4: PCB_3U_DAC (J1.4 J3.10), U_Output_channel4 (L4_4.4)
DAC_OUT_P5: PCB_3U_DAC (J1.5 J3.13), U_Output_channel5 (L4_5.4)
DAC_OUT_P6: PCB_3U_DAC (J1.6 J3.16), U_Output_channel6 (L4_6.4)
DAC_OUT_P7: PCB_3U_DAC (J1.7 J3.19), U_Output_channel7 (L4_7.4)
DAC_OUT_P8: PCB_3U_DAC (J1.8 J3.22), U_Output_channel8 (L4_8.4)
DAC_OUT_P9: PCB_3U_DAC (J1.9 J4.1), U_Output_channel9 (L4_9.4)
DAC_OUT_P10: PCB_3U_DAC (J1.10 J4.4), U_Output_channel10 (L4_10.4)
DAC_OUT_P11: PCB_3U_DAC (J1.11 J4.7), U_Output_channel11 (L4_11.4)
DAC_OUT_P12: PCB_3U_DAC (J1.12 J4.10), U_Output_channel12 (L4_12.4)
DAC_OUT_P13: PCB_3U_DAC (J1.13 J4.13), U_Output_channel13 (L4_13.4)
DAC_OUT_P14: PCB_3U_DAC (J1.14 J4.16), U_Output_channel14 (L4_14.4)
DAC_OUT_P15: PCB_3U_DAC (J1.15 J4.19), U_Output_channel15 (L4_15.4)
DAC_OUT_P16: PCB_3U_DAC (J1.16 J4.22), U_Output_channel16 (L4_16.4)
DAC_OUT_P17: PCB_3U_DAC (J1.19 J5.1), U_Output_channel17 (L4_17.4)
DAC_OUT_P18: PCB_3U_DAC (J1.20 J5.4), U_Output_channel18 (L4_18.4)
DAC_OUT_P19: PCB_3U_DAC (J1.21 J5.7), U_Output_channel19 (L4_19.4)
DAC_OUT_P20: PCB_3U_DAC (J1.22 J5.10), U_Output_channel20 (L4_20.4)
DAC_OUT_P21: PCB_3U_DAC (J1.23 J5.13), U_Output_channel21 (L4_21.4)
DAC_OUT_P22: PCB_3U_DAC (J1.24 J5.16), U_Output_channel22 (L4_22.4)
DAC_OUT_P23: PCB_3U_DAC (J1.25 J5.19), U_Output_channel23 (L4_23.4)
DAC_OUT_P24: PCB_3U_DAC (J1.26 J5.22), U_Output_channel24 (L4_24.4)
DAC_OUT_P25: PCB_3U_DAC (J1.27 J7.1), U_Output_channel25 (L4_25.4)
DAC_OUT_P26: PCB_3U_DAC (J1.28 J7.4), U_Output_channel26 (L4_26.4)
DAC_OUT_P27: PCB_3U_DAC (J1.29 J7.7), U_Output_channel27 (L4_27.4)
DAC_OUT_P28: PCB_3U_DAC (J1.30 J7.10), U_Output_channel28 (L4_28.4)
DAC_OUT_P29: PCB_3U_DAC (J1.31 J7.13), U_Output_channel29 (L4_29.4)
DAC_OUT_P30: PCB_3U_DAC (J1.32 J7.16), U_Output_channel30 (L4_30.4)
DAC_OUT_P31: PCB_3U_DAC (J1.33 J7.19), U_Output_channel31 (L4_31.4)
DAC_OUT_P32: PCB_3U_DAC (J1.34 J7.22), U_Output_channel32 (L4_32.4)
NetIC13_4: LVDS_IFC_DAC (IC13.4), Thermal_MGM (R81.1)
NetIC13_5: LVDS_IFC_DAC (IC13.5), Thermal_MGM (R71.1)
NetIC13_10: PCB_3U_DAC (IC19.3), LVDS_IFC_DAC (IC13.10 R12.2)
NetIC18_1: PCB_3U_DAC (IC19.2), DAC_32CH (IC18.1)
NetIC18_2: DAC_32CH (IC18.2), LVDS_IFC_DAC (R51.1)
NetIC18_53: DAC_32CH (IC18.53), LVDS_IFC_DAC (R97.1)
NetIC18_56: DAC_32CH (IC18.56), LVDS_IFC_DAC (R14.1)
NetIC18_63: DAC_32CH (IC18.63), LVDS_IFC_DAC (R101.1)
NetIC18_64: DAC_32CH (IC18.64), LVDS_IFC_DAC (R88.1)
SCKI: PCB_3U_DAC (IC23.11 R117.2), DAC_32CH (IC18.54 R82.2), LVDS_IFC_DAC (R11.1)
SDI: PCB_3U_DAC (IC23.14 R116.2), DAC_32CH (IC18.55 R58.2), LVDS_IFC_DAC (R13.1)
VOUT1: U_Output_channel1 (R24_1.1), DAC_32CH (IC18.42)
VOUT2: U_Output_channel2 (R24_2.1), DAC_32CH (IC18.43)
VOUT3: U_Output_channel3 (R24_3.1), DAC_32CH (IC18.44)
VOUT4: U_Output_channel4 (R24_4.1), DAC_32CH (IC18.45)
VOUT5: U_Output_channel5 (R24_5.1), DAC_32CH (IC18.47)
VOUT6: U_Output_channel6 (R24_6.1), DAC_32CH (IC18.48)
VOUT7: U_Output_channel7 (R24_7.1), DAC_32CH (IC18.49)
VOUT8: U_Output_channel8 (R24_8.1), DAC_32CH (IC18.50)
VOUT9: U_Output_channel9 (R24_9.1), DAC_32CH (IC18.21)
VOUT10: U_Output_channel10 (R24_10.1), DAC_32CH (IC18.22)
VOUT11: U_Output_channel11 (R24_11.1), DAC_32CH (IC18.23)
VOUT12: U_Output_channel12 (R24_12.1), DAC_32CH (IC18.24)
VOUT13: U_Output_channel13 (R24_13.1), DAC_32CH (IC18.26)
VOUT14: U_Output_channel14 (R24_14.1), DAC_32CH (IC18.27)
VOUT15: U_Output_channel15 (R24_15.1), DAC_32CH (IC18.28)
VOUT16: U_Output_channel16 (R24_16.1), DAC_32CH (IC18.29)
VOUT17: U_Output_channel17 (R24_17.1), DAC_32CH (IC18.30)
VOUT18: U_Output_channel18 (R24_18.1), DAC_32CH (IC18.31)
VOUT19: U_Output_channel19 (R24_19.1), DAC_32CH (IC18.32)
VOUT20: U_Output_channel20 (R24_20.1), DAC_32CH (IC18.33)
VOUT21: U_Output_channel21 (R24_21.1), DAC_32CH (IC18.37)
VOUT22: U_Output_channel22 (R24_22.1), DAC_32CH (IC18.38)
VOUT23: U_Output_channel23 (R24_23.1), DAC_32CH (IC18.39)
VOUT24: U_Output_channel24 (R24_24.1), DAC_32CH (IC18.40)
VOUT25: U_Output_channel25 (R24_25.1), DAC_32CH (IC18.60)
VOUT26: U_Output_channel26 (R24_26.1), DAC_32CH (IC18.61)
VOUT27: U_Output_channel27 (R24_27.1), DAC_32CH (IC18.62)
VOUT28: U_Output_channel28 (R24_28.1), DAC_32CH (IC18.3)
VOUT29: U_Output_channel29 (R24_29.1), DAC_32CH (IC18.5)
VOUT30: U_Output_channel30 (R24_30.1), DAC_32CH (IC18.6)
VOUT31: U_Output_channel31 (R24_31.1), DAC_32CH (IC18.7)
VOUT32: U_Output_channel32 (R24_32.1), DAC_32CH (IC18.8)